# Altium schematic sheet var 9.SchDoc
size 304 x 215 mm; Organization: РС/c-20-1-о; DocumentNumber: СРДТ.431324.001 Э3; Revision: rev; SheetNumber: 1; SheetTotal: 1; Perv_primenenie: СРДТ.431324.001; Proveril: Щекатурин; Razrabotal: Литовко; Doc_Type_1str: Схема электрическая; Doc_Type_2str: принципиальная
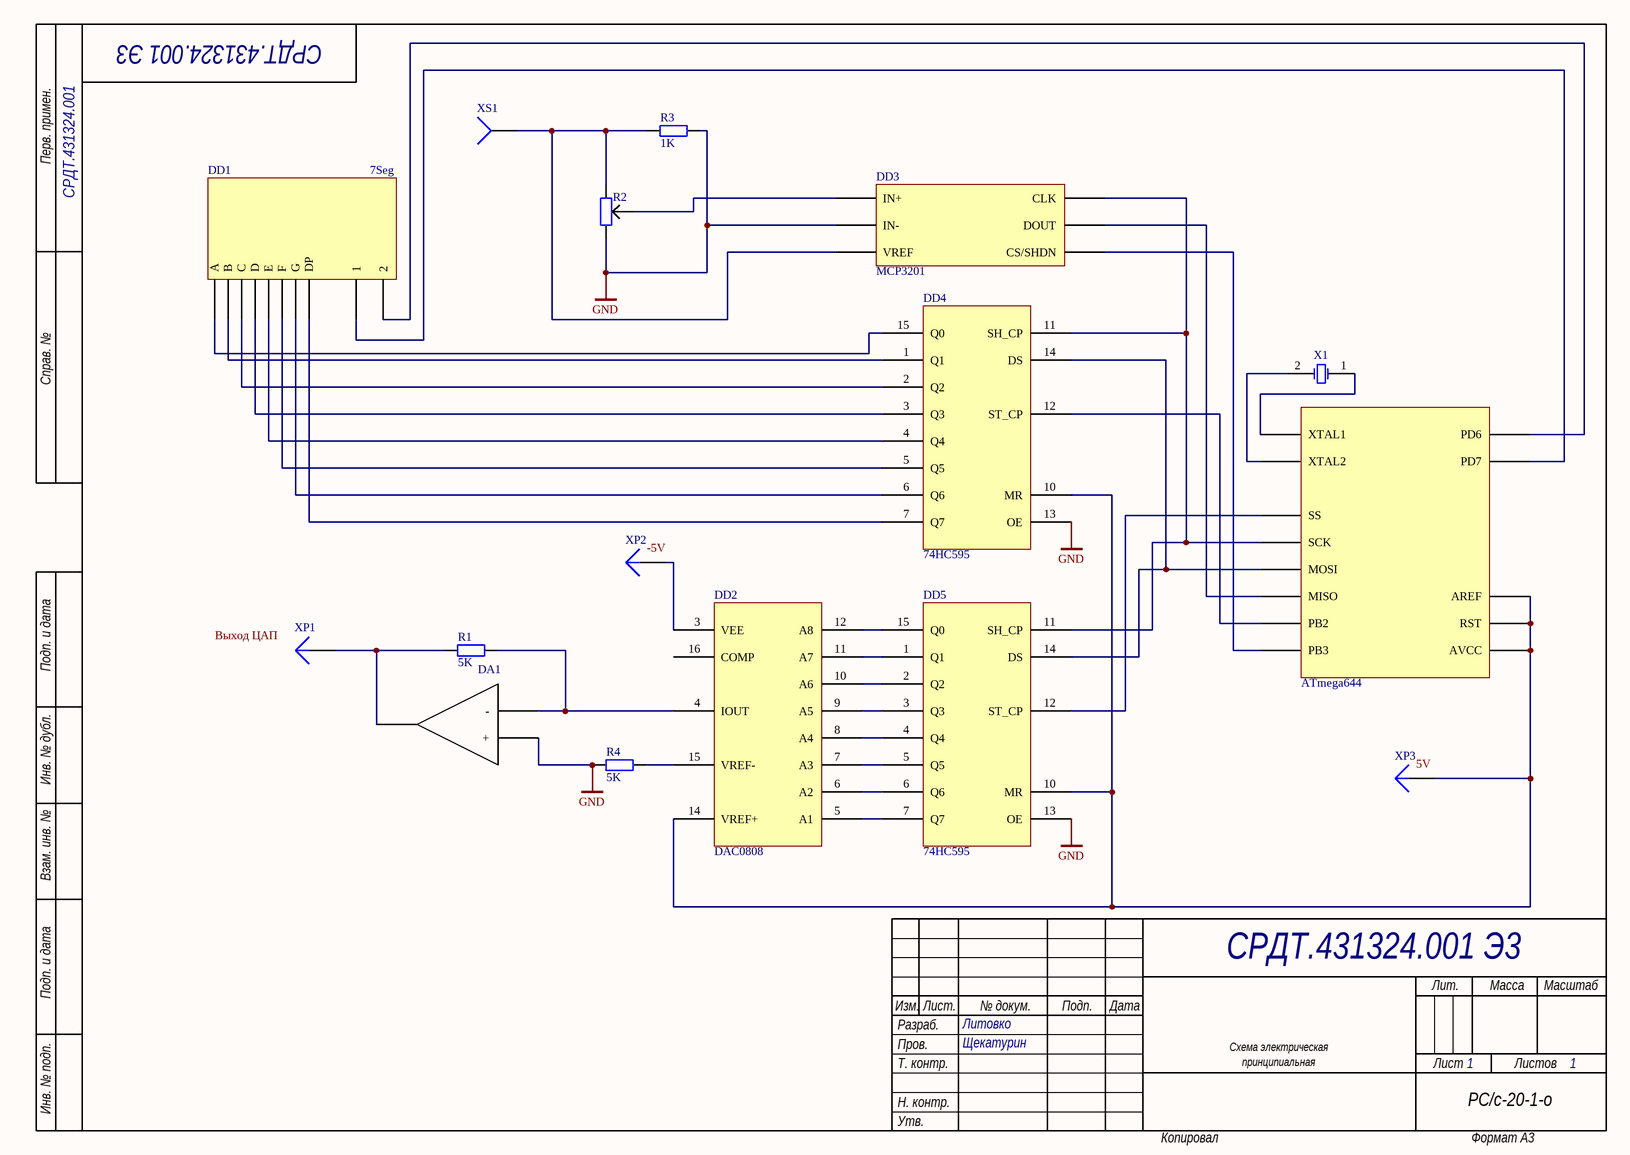
[diagram p0: var 9.SchDoc]

## Parts
*  Potentiometr  (value not drawn)
ATmega644  mcu  (value not drawn)
DA1  OP1P  (value not drawn)
DD1  7Seg
DD2  DAC0808
DD3  MCP3201
DD4  74HC595
DD5  74HC595
R1  value 5K  [AXIAL-0.4]  (hidden comment: Res2)
R2  Res2  [AXIAL-0.4]  (value not drawn)
R3  value 1K  [AXIAL-0.4]  (hidden comment: Res2)
R4  value 5K  [AXIAL-0.4]  (hidden comment: Res2)
X1  XTAL  [R38]  (value not drawn)
XP1  Plug  [PIN1]  (value not drawn)
XP2  Plug  [PIN1]  (value not drawn)
XP3  Plug  [PIN1]  (value not drawn)
XS1  Socket  [PIN1]  (value not drawn)

## Nets
GND: DA1.33(+) DD3.3(IN-) DD4.13(OE) DD5.13(OE) R2.1 R3.2 R4.1
Net*_34: *.34 DD3.2(IN+)
NetATmega644_2: ATmega644.2(SS) DD5.12(ST_CP)
NetATmega644_3: ATmega644.3(SCK) DD3.15(CLK) DD4.11(SH_CP) DD5.11(SH_CP)
NetATmega644_4: ATmega644.4(MOSI) DD4.14(DS) DD5.14(DS)
NetATmega644_5: ATmega644.5(MISO) DD3.RST(DOUT)
NetATmega644_6: ATmega644.6(PB2) DD4.12(ST_CP)
NetATmega644_7: ATmega644.7(PB3) DD3.16(CS/SHDN)
NetATmega644_8: ATmega644.8(PD6) DD1.44(2)
NetATmega644_9: ATmega644.9(PD7) DD1.43(1)
NetATmega644_15: ATmega644.15(AREF) ATmega644.16(AVCC) ATmega644.RST DD2.14(VREF+) DD4.10(MR) DD5.10(MR) XP3.1
NetATmega644_17: ATmega644.17(XTAL2) X1.2(OSC2)
NetATmega644_XTAL1: ATmega644.XTAL1 X1.1(OSC1)
NetDA1_31: DA1.31 R1.1 XP1.1
NetDA1_32: DA1.32(-) DD2.4(IOUT) R1.2
NetDD1_35: DD1.35(A) DD4.15(Q0)
NetDD1_36: DD1.36(B) DD4.1(Q1)
NetDD1_37: DD1.37(C) DD4.2(Q2)
NetDD1_38: DD1.38(D) DD4.3(Q3)
NetDD1_39: DD1.39(E) DD4.4(Q4)
NetDD1_40: DD1.40(F) DD4.5(Q5)
NetDD1_41: DD1.41(G) DD4.6(Q6)
NetDD1_42: DD1.42(DP) DD4.7(Q7)
NetDD2_3: DD2.3(VEE) XP2.1
NetDD2_5: DD2.5(A1) DD5.7(Q7)
NetDD2_6: DD2.6(A2) DD5.6(Q6)
NetDD2_7: DD2.7(A3) DD5.5(Q5)
NetDD2_8: DD2.8(A4) DD5.4(Q4)
NetDD2_9: DD2.9(A5) DD5.3(Q3)
NetDD2_10: DD2.10(A6) DD5.2(Q2)
NetDD2_11: DD2.11(A7) DD5.1(Q1)
NetDD2_12: DD2.12(A8) DD5.15(Q0)
NetDD2_15: DD2.15(VREF-) R4.2
NetDD3_4: DD3.4(VREF) R2.2 R3.1 XS1.1

Not connected (* = marked no-connect by the designer): DD2 16(COMP)

## Notes on the sheet
- Labels drawn without touching a wire or pin: 5V, -5V, Выход ЦАП
- Перв. примен.
- Справ. №
- Подп. и дата
- Инв. № дубл.
- Взам. инв. №
- Изм.
- Разраб.
- Лист.
- № докум.
- Подп.
- Дата
- Лит.
- Масса
- Масштаб
- Инв. № подп.
- Пров.
- Т. контр.
- Н. контр.
- Лист
- Листов
- Утв.
- Копировал
- Формат А3

## Library data of the parts
R1 R3 R4 = Res2: Resistor; Published: 8-Jun-2000; LatestRevisionDate: 17-Jul-2002; LatestRevisionNote: Re-released for DXP Platform.; PackageReference: AXIAL-0.4; Publisher: Altium Limited; PackageDescription: Axial Device, Thru-Hole; 2 Leads; 0.4 in Pin Spacing
R2 = Res2: Resistor; Value: 1K; Published: 8-Jun-2000; LatestRevisionDate: 17-Jul-2002; LatestRevisionNote: Re-released for DXP Platform.; PackageReference: AXIAL-0.4; Publisher: Altium Limited; PackageDescription: Axial Device, Thru-Hole; 2 Leads; 0.4 in Pin Spacing
X1 = XTAL: Crystal Oscillator; Published: 8-Jun-2000; LatestRevisionDate: 17-Jul-2002; LatestRevisionNote: Re-released for DXP Platform.; PackageReference: R38; Publisher: Altium Limited; PackageDescription: Crystal, Thru-Hole; 2 Leads; Body 3.1 x 8.2 mm (Dia.xH)
XP1-XP3 = Plug: LatestRevisionDate: 17-Jul-2002; LatestRevisionNote: Re-released for DXP Platform.; Publisher: Altium Limited
XS1 = Socket: LatestRevisionDate: 17-Jul-2002; LatestRevisionNote: Re-released for DXP Platform.; Publisher: Altium Limited